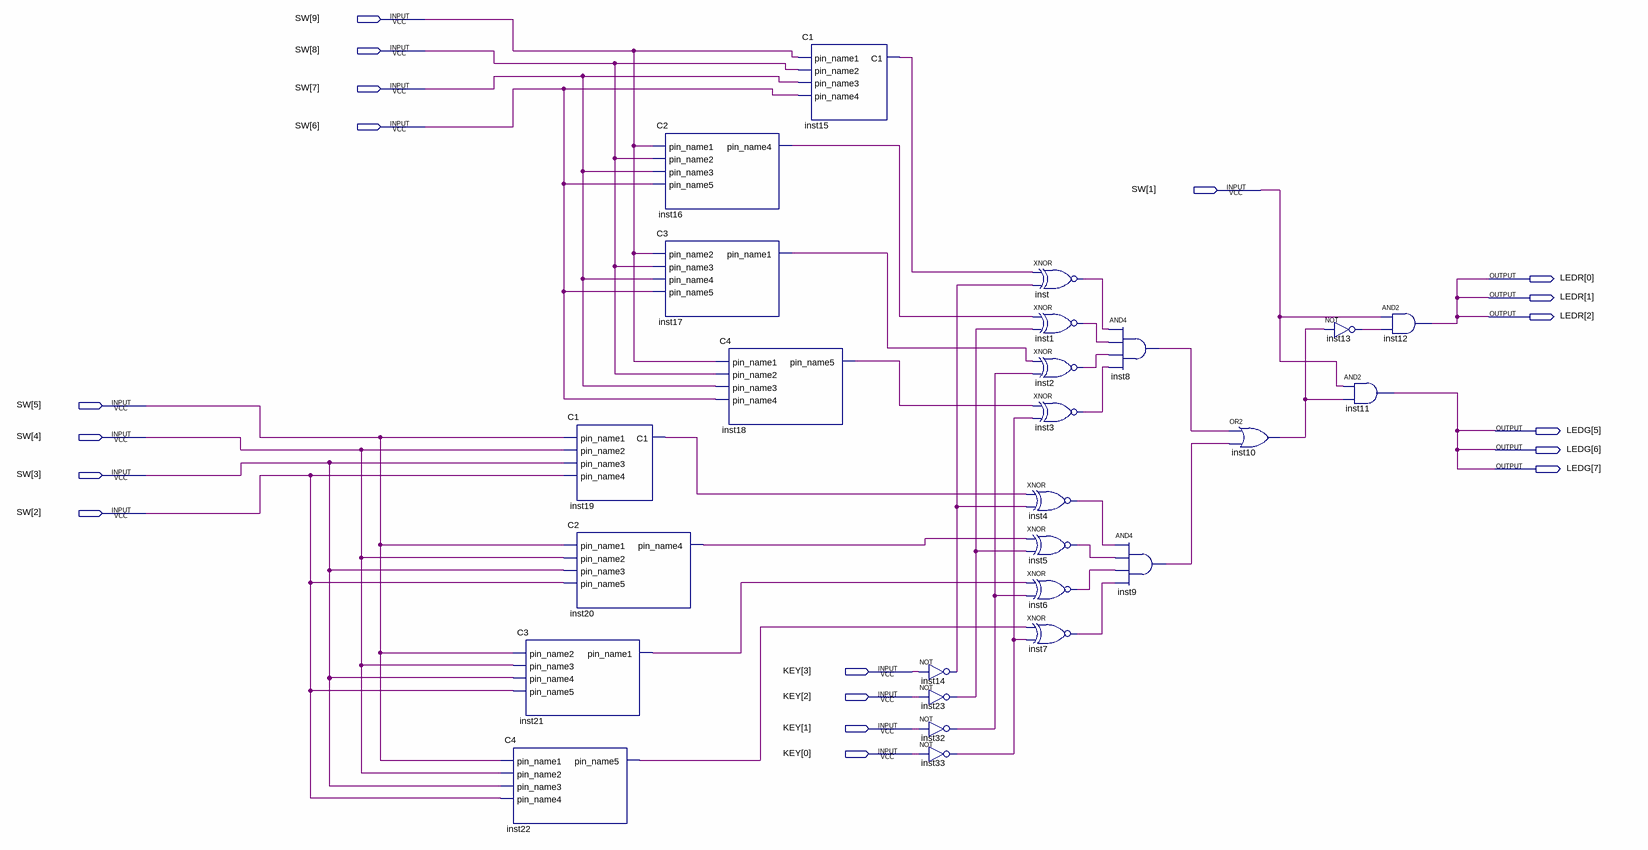
[diagram p0: schematic sheet]
// Quartus schematic MAIN.bdf as structural Verilog: 26 symbols, 19 pins
module MAIN (
  input  [9:1] SW,
  input  [3:0] KEY,
  output [2:0] LEDR,
  output [7:5] LEDG
);

  wire inst1_out, inst2_out, inst3_out, inst4_out, inst5_out, inst6_out, inst7_out, inst8_out, inst9_out,
       inst10_out, inst13_out, inst14_out, inst15_c1, inst16_pin_name4, inst17_pin_name1, inst18_pin_name5,
       inst19_c1, inst20_pin_name4, inst21_pin_name1, inst22_pin_name5, inst23_out, inst32_out, inst33_out,
       inst_out;

  C4 inst22 (.pin_name1(SW[5]), .pin_name2(SW[4]), .pin_name3(SW[3]), .pin_name4(SW[2]), .pin_name5(inst22_pin_name5));
  C3 inst21 (.pin_name2(SW[5]), .pin_name3(SW[4]), .pin_name4(SW[3]), .pin_name5(SW[2]), .pin_name1(inst21_pin_name1));
  C1 inst19 (.pin_name1(SW[5]), .pin_name2(SW[4]), .pin_name3(SW[3]), .pin_name4(SW[2]), .C1(inst19_c1));
  C2 inst20 (.pin_name1(SW[5]), .pin_name2(SW[4]), .pin_name3(SW[3]), .pin_name5(SW[2]), .pin_name4(inst20_pin_name4));
  C2 inst16 (.pin_name1(SW[9]), .pin_name2(SW[8]), .pin_name3(SW[7]), .pin_name5(SW[6]), .pin_name4(inst16_pin_name4));
  C3 inst17 (.pin_name2(SW[9]), .pin_name3(SW[8]), .pin_name4(SW[7]), .pin_name5(SW[6]), .pin_name1(inst17_pin_name1));
  C4 inst18 (.pin_name1(SW[9]), .pin_name2(SW[8]), .pin_name3(SW[7]), .pin_name4(SW[6]), .pin_name5(inst18_pin_name5));
  C1 inst15 (.pin_name1(SW[9]), .pin_name2(SW[8]), .pin_name3(SW[7]), .pin_name4(SW[6]), .C1(inst15_c1));
  not inst14 (inst14_out, KEY[3]);
  not inst23 (inst23_out, KEY[2]);
  not inst32 (inst32_out, KEY[1]);
  not inst33 (inst33_out, KEY[0]);
  xnor inst (inst_out, inst15_c1, inst14_out);
  xnor inst1 (inst1_out, inst16_pin_name4, inst23_out);
  xnor inst2 (inst2_out, inst17_pin_name1, inst32_out);
  xnor inst3 (inst3_out, inst18_pin_name5, inst33_out);
  xnor inst4 (inst4_out, inst19_c1, inst14_out);
  xnor inst5 (inst5_out, inst20_pin_name4, inst23_out);
  xnor inst6 (inst6_out, inst21_pin_name1, inst32_out);
  xnor inst7 (inst7_out, inst22_pin_name5, inst33_out);
  and inst8 (inst8_out, inst_out, inst1_out, inst2_out, inst3_out);
  and inst9 (inst9_out, inst4_out, inst5_out, inst6_out, inst7_out);
  or inst10 (inst10_out, inst8_out, inst9_out);
  not inst13 (inst13_out, inst10_out);
  and inst11 (LEDG[7], SW[1], inst10_out);
  and inst12 (LEDR[2], SW[1], inst13_out);

  assign LEDG[6:5] = {2{LEDG[7]}};
  assign LEDR[1:0] = {2{LEDR[2]}};
endmodule
